# Altium schematic sheet Main.SchDoc: Repeating a sequence
size A3; Author: Idolova Anna; Revision: Version 1.0; SheetNumber: 1; SheetTotal: 2
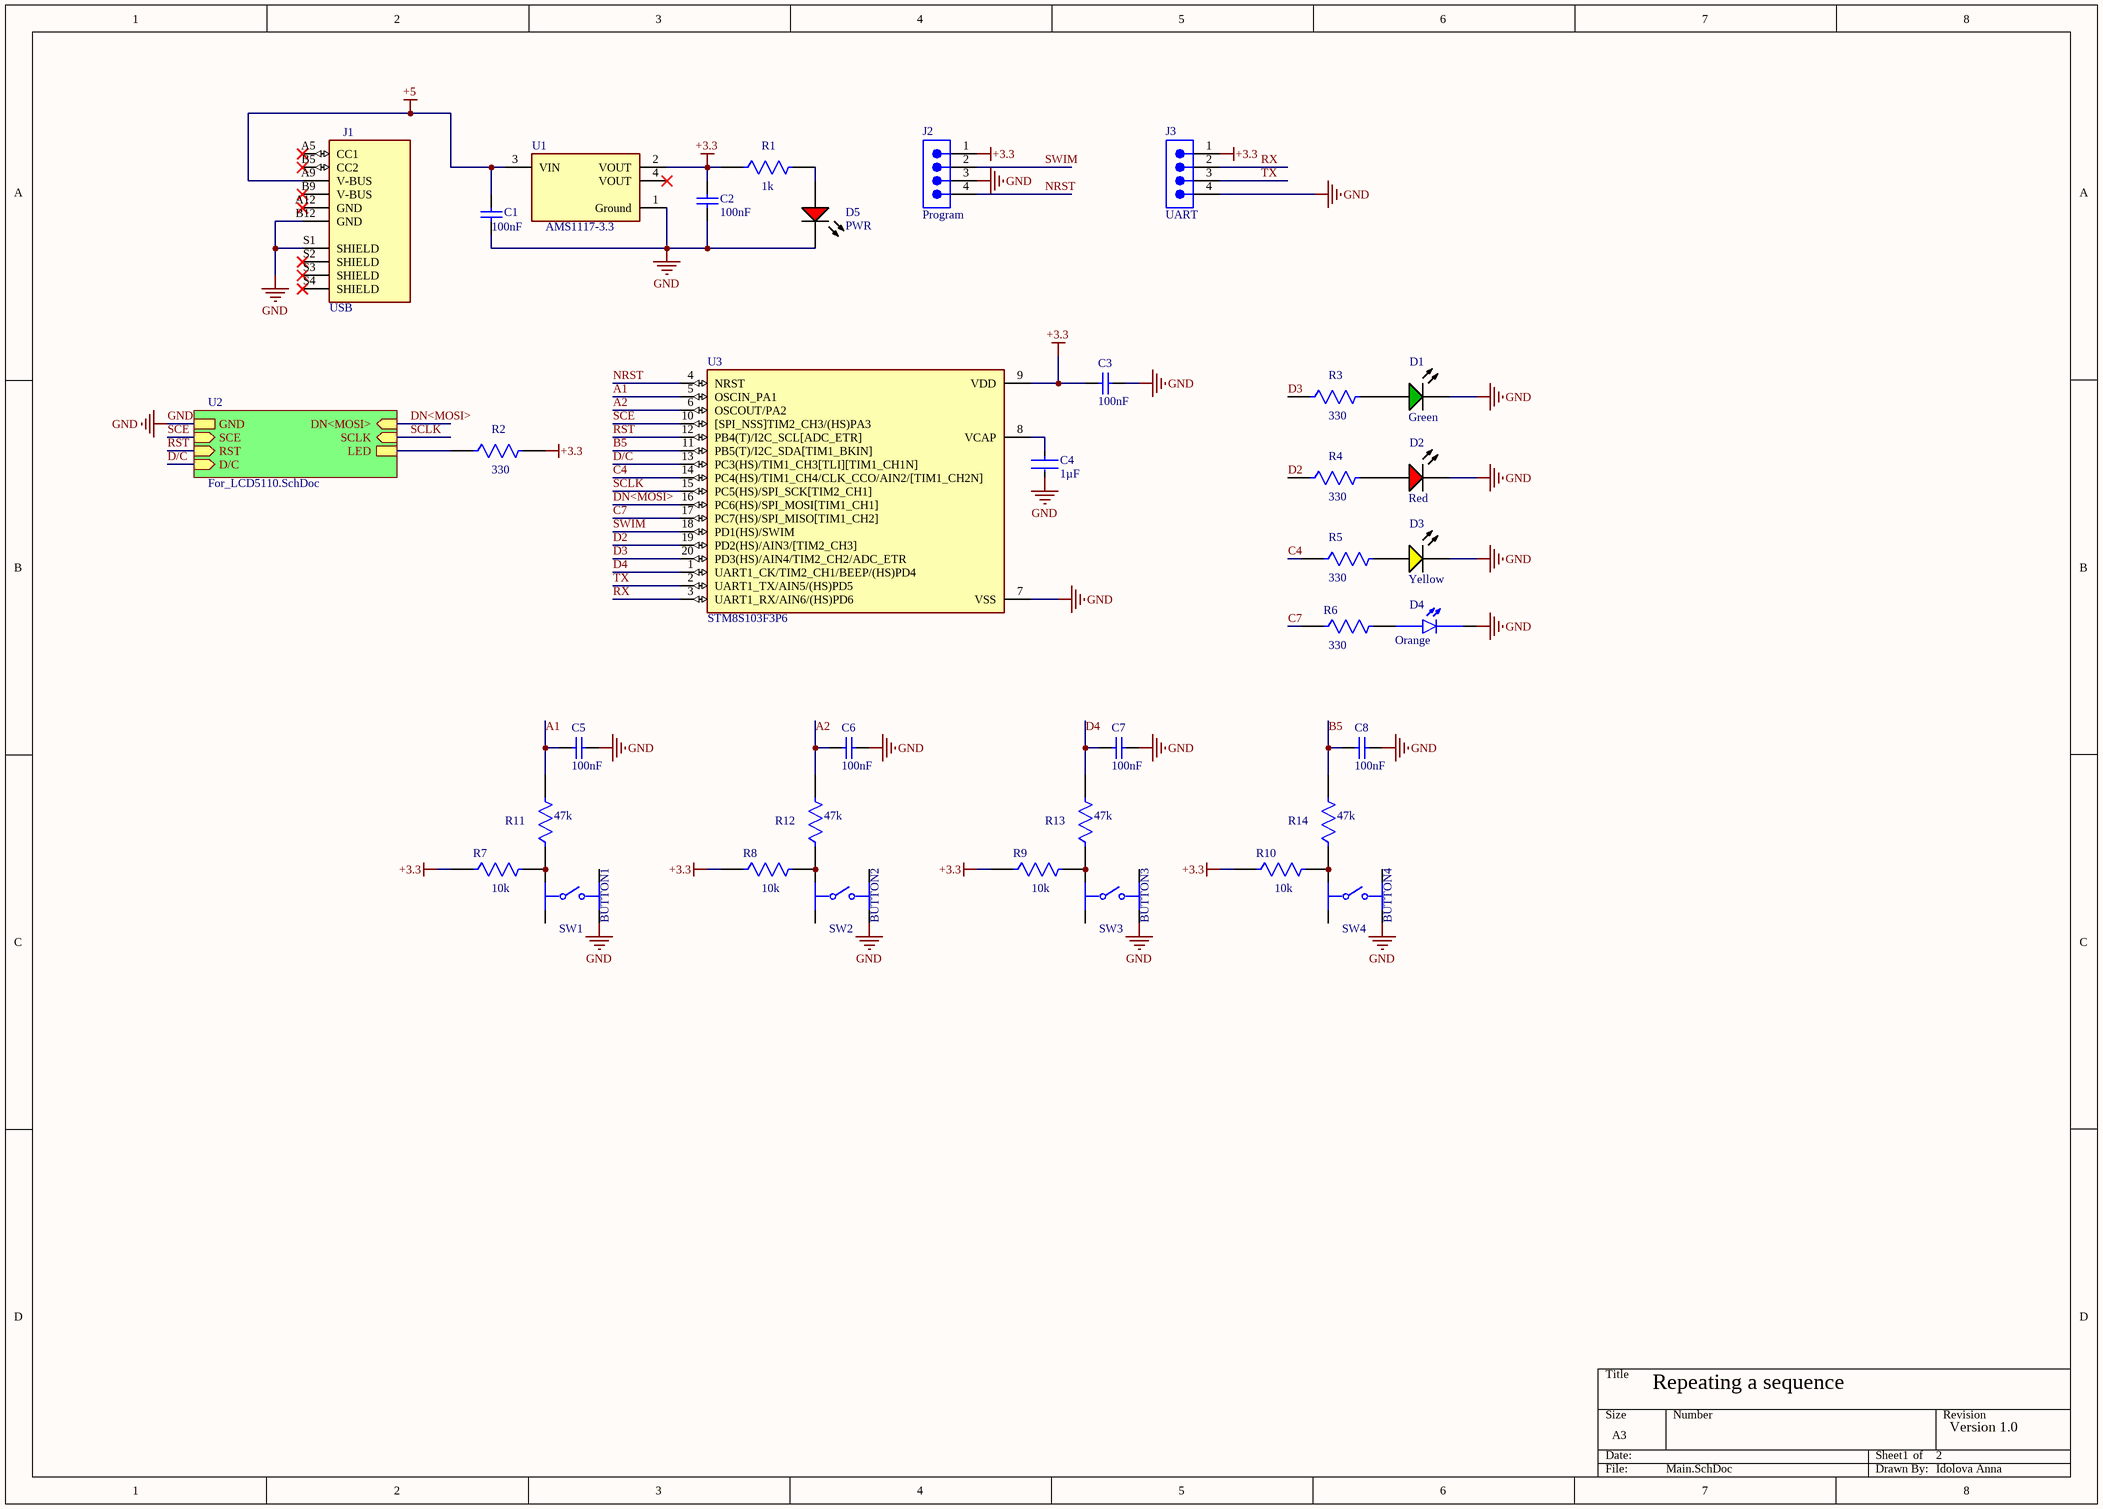
[diagram p0: Main.SchDoc]

## Parts
C1  value 100nF  [CAPC1206(3216)100_N]  (hidden comment: CAPACITOR_1206ZC104JAT2A)
C2  value 100nF  [CAPC1206(3216)100_N]  (hidden comment: CAPACITOR_1206ZC104JAT2A)
C3  value 100nF  [CAPC1206(3216)100_N]  (hidden comment: CAPACITOR_1206ZC104JAT2A)
C4  value 1µF  [FP-CL21-IPC_B]  (hidden comment: CL21F105ZAFNNNF)
C5  value 100nF  [CAPC1206(3216)100_N]  (hidden comment: CAPACITOR_1206ZC104JAT2A)
C6  value 100nF  [CAPC1206(3216)100_N]  (hidden comment: CAPACITOR_1206ZC104JAT2A)
C7  value 100nF  [CAPC1206(3216)100_N]  (hidden comment: CAPACITOR_1206ZC104JAT2A)
C8  value 100nF  [CAPC1206(3216)100_N]  (hidden comment: CAPACITOR_1206ZC104JAT2A)
D1  Green  [KING-WP7113SGD_V]
D2  Red  [KING-WP7113SRDD_V]
D3  Yellow  [KING-WP7113SYD_V]
D4  Orange  [LED_WP7113SEC]
D5  PWR  [KING-WP7113SRDD_V]
J1  USB  [CUI_UJC-HP-3-SMT-TR]
J2  Program  [61300411021]
J3  UART  [61300411021]
R1  value 1k  [FP-RC1005-IPC_C]  (hidden comment: RESISTOR__RC1005F102CS)
R2  value 330  [FP-MCR18-IPC_B]  (hidden comment: MCR18EZPF3300)
R3  value 330  [FP-MCR18-IPC_B]  (hidden comment: MCR18EZPF3300)
R4  value 330  [FP-MCR18-IPC_B]  (hidden comment: MCR18EZPF3300)
R5  value 330  [FP-MCR18-IPC_B]  (hidden comment: MCR18EZPF3300)
R6  value 330  [FP-MCR18-IPC_B]  (hidden comment: MCR18EZPF3300)
R7  value 10k  [FP-TFCR0402-IPC_A]  (hidden comment: TFCR0402-16W-C-1002BT)
R8  value 10k  [FP-TFCR0402-IPC_A]  (hidden comment: TFCR0402-16W-C-1002BT)
R9  value 10k  [FP-TFCR0402-IPC_A]  (hidden comment: TFCR0402-16W-C-1002BT)
R10  value 10k  [FP-TFCR0402-IPC_A]  (hidden comment: TFCR0402-16W-C-1002BT)
R11  value 47k  [FP-RC1005-IPC_C]  (hidden comment: RESISTOR__RC1005F102CS)
R12  value 47k  [FP-RC1005-IPC_C]  (hidden comment: RESISTOR__RC1005F102CS)
R13  value 47k  [FP-RC1005-IPC_C]  (hidden comment: RESISTOR__RC1005F102CS)
R14  value 47k  [FP-RC1005-IPC_C]  (hidden comment: RESISTOR__RC1005F102CS)
SW1  BUTTON1  [FP-PTS645SM43SMTR92LFS-MFG]
SW2  BUTTON2  [FP-PTS645SM43SMTR92LFS-MFG]
SW3  BUTTON3  [FP-PTS645SM43SMTR92LFS-MFG]
SW4  BUTTON4  [FP-PTS645SM43SMTR92LFS-MFG]
U1  AMS1117-3.3  [FP-AMS1117-IPC_B]
U3  STM8S103F3P6  [SOP65P640X120-20N]

## Sub-sheets
U2 = For_LCD5110.SchDoc: GND, SCE (in), RST (in), D/C (in), DN<MOSI> (in), SCLK (in), LED

## Nets
+3.3: C2.2 C3.1 J2.1 J3.1 R1.1 R2.2 R7.1 R8.1 R9.1 R10.1 U1.2(VOUT) U3.9(VDD)
+5: C1.2 J1.A9(V-BUS) U1.3(VIN)
GND: C1.1 C2.1 C3.2 C4.2 C5.2 C6.2 C7.2 C8.2 D1.2(K) D2.2(K) D3.2(K) D4.C D5.2(K) J1.B12(GND) J1.S1(SHIELD) J2.3 J3.4 SW1.2 SW2.2 SW3.2 SW4.2 U1.1(Ground) U3.7(VSS) ; sheet U2/GND
A1: C5.1 R11.1 U3.5(OSCIN_PA1)
A2: C6.1 R12.1 U3.6(OSCOUT/PA2)
B5: C8.1 R14.1 U3.11(PB5(T)/I2C_SDA[TIM1_BKIN])
C4: R5.1 U3.14(PC4(HS)/TIM1_CH4/CLK_CCO/AIN2/[TIM1_CH2N])
C7: R6.1 U3.17(PC7(HS)/SPI_MISO[TIM1_CH2])
D2: R4.1 U3.19(PD2(HS)/AIN3/[TIM2_CH3])
D3: R3.1 U3.20(PD3(HS)/AIN4/TIM2_CH2/ADC_ETR)
D4: C7.1 R13.1 U3.1(UART1_CK/TIM2_CH1/BEEP/(HS)PD4)
D/C: U3.13(PC3(HS)/TIM1_CH3[TLI][TIM1_CH1N]) ; sheet U2/D/C
DN<MOSI>: U3.16(PC6(HS)/SPI_MOSI[TIM1_CH1]) ; sheet U2/DN<MOSI>
NRST: J2.4 U3.4(NRST)
RST: U3.12(PB4(T)/I2C_SCL[ADC_ETR]) ; sheet U2/RST
RX: J3.2 U3.3(UART1_RX/AIN6/(HS)PD6)
SCE: U3.10([SPI_NSS]TIM2_CH3/(HS)PA3) ; sheet U2/SCE
SCLK: U3.15(PC5(HS)/SPI_SCK[TIM2_CH1]) ; sheet U2/SCLK
SWIM: J2.2 U3.18(PD1(HS)/SWIM)
TX: J3.3 U3.2(UART1_TX/AIN5/(HS)PD5)
NetC4_1: C4.1 U3.8(VCAP)
NetD1_1: D1.1(A) R3.2
NetD2_1: D2.1(A) R4.2
NetD5_1: D5.1(A) R1.2
NetR2_1: R2.1 ; sheet U2/LED
NetR7_2: R7.2 R11.2 SW1.3
NetR8_2: R8.2 R12.2 SW2.3
NetR9_2: R9.2 R13.2 SW3.3
NetR10_2: R10.2 R14.2 SW4.3

Not connected (* = marked no-connect by the designer): D3 1(A); D4 A; J1 A5(CC1)* A12(GND)* B5(CC2)* B9(V-BUS)* S2(SHIELD)* S3(SHIELD)* S4(SHIELD)*; R5 2; R6 2; SW1 1 4; SW2 1 4; SW3 1 4; SW4 1 4; U1 4(VOUT)*

## Library data of the parts
C1-C3 C5-C8 = CMP-001-00221-1: Ceramic Capacitor, Multilayer, Ceramic, 10V, 5% +Tol, 5% -Tol, X7R, 15% TC, 0.1uF, Surface Mount, 1206; Multilayer: Yes; JESD-609 Code: e3; Tolerance (fill in as +-): 5%; Case/Package: 1206; Length: 3.2mm; Max Operating Temperature: 125°C; Width: 1.6mm; Rated DC Voltage (URdc): 10V; Temperature Characteristics Code: X7R; Min Operating Temperature: -55°C; Mounting Technology: Surface Mount; Termination: Wraparound; Pins: 2; Dielectric Material: Ceramic; Tolerance  (fill in as +-): 5%; Terminal Finish: Nickel; Package Style: SMTMeter; Package Shape: Rectangular; RoHS Compliant: Yes; Packaging: Tape and Reel; Capacitor Type: Ceramic; Height: 0.94mm; Reach SVHC Compliant: Yes
C4 = CMP-001-00222-1: Ceramic Capacitor, Multilayer, Ceramic, 25V, 80% +Tol, 20% -Tol, Y5V, -82/+22% TC, 1uF, Surface Mount, 0805; Multilayer: Yes; Dielectric Material: Ceramic; Min Operating Temperature: -30°C; Tolerance (fill in as +-): 80%; Termination: Wraparound; Rated DC Voltage (URdc): 25V; Terminal Finish: Nickel; RoHS Compliant: Yes; Temperature Characteristics Code: Y5V; Package Style: SMTMeter; Max Operating Temperature: 85°C; Reach SVHC Compliant: Yes; Width: 1.25mm; Package Shape: Rectangular; Length: 2mm; Tolerance  (fill in as +-): 20%; Case/Package: 0805; Height: 1.35mm; Packaging: Tape and Reel; Capacitor Type: Ceramic; Mounting Technology: Surface Mount; JESD-609 Code: e3; Pins: 2
D1 = CMP-007-00010-2: LED Green, 62.5 mW, 25 mA, -40 to 85 degC, 2-Pin THD, RoHS, Bulk; Manufacturer: Kingbright; Lens Style: Dome; Nominal Vf: 2.2V; Power: 62.5mW; Luminous Intensity: 40mcd; Viewing Angle: 30degrees; Datasheet URL: http://www.kingbrightusa.com/images/catalog/SPEC/WP7113SGD.pdf; Datasheet Version: Rev. 6B, 01/2015; Illumination Colour: Green; Package Quantity: 1000; Package Description: 2-Pin Through Hole Device, Dia 5.9 mm, Body Length 8.6 mm; Colour: Green; Case/Package: Radial; RoHS Compliant: True; Package Reference: WP7113SGD; Mounting Technology: TH; Packaging: Bulk; Forward Voltage: 2.2V
D2 D5 = CMP-007-00033-2: The Super Bright Red Source Color Device, 1.85 V, -40 to 85 degC, 2-Pin THD, RoHS, Tape and Reel; Manufacturer: Kingbright; Nominal Vf: 1.85V; Luminous Intensity: 300mcd; Viewing Angle: 30degrees; Lens Style: Diffused; RoHS Compliant: True; Datasheet Version: Rev. 6A, 07/2016; Illumination Colour: Red; Case/Package: Radial; Package Reference: WP7113SRDD; Package Quantity: 500; Datasheet URL: http://www.kingbrightusa.com/images/catalog/SPEC/WP7113SRD-D.pdf; Colour: Red; Packaging: Bulk; Forward Voltage: 1.85V; Mounting Technology: TH; Package Description: 2-Pin Through Hole Device, Dia 5.9 mm, Body Length 8.6 mm
D3 = CMP-007-00034-2: The Super Bright Yellow Source Color Device, 2 V, -40 to 85 degC, 2-Pin THD, RoHS, Tape and Reel; Manufacturer: Kingbright; Nominal Vf: 2V; Viewing Angle: 30degrees; Luminous Intensity: 600mcd; Forward Current: 20mA; Lens Style: Diffused; Datasheet Version: Rev. 7B, 01/2015; RoHS Compliant: True; Datasheet URL: http://www.kingbrightusa.com/images/catalog/SPEC/WP7113SYD.pdf; Illumination Colour: Yellow; Package Reference: WP7113SYD; Mounting Technology: TH; Package Quantity: 500; Packaging: Bulk; Package Description: 2-Pin Through Hole Device, Dia 5.9 mm, Body Length 8.6 mm; Case/Package: Radial; Colour: Yellow; Forward Voltage: 2V
D4 = CMP-004-00038-1: LED Thru-Hole Orange T1-3/4 5mm Clear Lens 30mA 610nm 2500mcd Round; MF: Kingbright; Source: WP7113SEC.SchLib; Check_prices: https://www.snapeda.com/parts/WP7113SEC/Kingbright/view-part/?ref=eda; Value: *; Case/Package: Radial Kingbright; MP: WP7113SEC; Component Type: Standard; Pins: 2; SnapEDA_Link: https://www.snapeda.com/parts/WP7113SEC/Kingbright/view-part/?ref=snap; Design Item ID: WP7113SEC
J1 = CMP-074-000000-1: Pin Count: 10; Design Item ID: UJC-HP-3-SMT-TR; Price: None; Availability: Unavailable; Component Type: Standard; Source: UJC-HP-3-SMT-TR.SchLib; Value: *; MP: UJC-HP-3-SMT-TR; Package: None
J2 J3 = CMP-043-000000-1: NexarPartId: 31153320; Gender: Male; Number of Positions: 4; Current Rating: 3A; Pitch: 2.54mm; Contact Resistance: 20m?; Connector Type: Male Pin; Operating Supply Voltage: 250V; Contact Mating Length: 5.9944mm; Number of Rows: 1; Contact Plating: Gold; Design Item ID: CMP-1502-01063-3; Lead Pitch: 2.54mm; Component Type: Standard; Number of Pins: 4; Number of Contacts: 4; Mount: Through Hole; REACH SVHC: Unknown; Source: Components - 25.08.25 - 11.48.SchLib; Contact Material: Copper; Pin Count: 4; Termination: Solder; RoHS: Compliant; Color: Black
R1 = CMP-009-00419-1: Fixed Resistor, Metal Glaze/thick Film, 0.06W, 1000ohm, 50V, 1% +/-Tol, 100ppm/Cel, Surface Mount, 0402; Package Height: 0.35mm; Power: 60mW; Package Length: 1mm; Package Width: 0.5mm; Temperature Coefficient (ppm/Cel): 100; JESD-609 Code: e3; Max Operating Temperature: 125°C; Resistor Type: FIXED RESISTOR; Pins: 2; Package Shape: Rectangular; Tolerance: 1%; Case/Package: 0402; Mounting Technology: Surface Mount; Reach SVHC Compliant: Yes; Packaging: Tape and Reel; RoHS Compliant: Yes; Technology: METAL GLAZE/THICK FILM; Min Operating Temperature: -55°C; Working Voltage: 50V; Construction: Chip; Terminal Finish: Nickel
R2-R6 = CMP-009-00420-1: Fixed Resistor, Metal Glaze/thick Film, 0.25W, 330ohm, 200V, 1% +/-Tol, 100ppm/Cel, Surface Mount, 1206; Temperature Coefficient (ppm/Cel): 100; Package Length: 3.2mm; Package Width: 1.6mm; Package Height: 0.55mm; Power: 250mW; Reference Standard: TS 16949; Rated Temperature: 70°C; JESD-609 Code: e3; Max Operating Temperature: 155°C; Tolerance: 1%; Mounting Technology: Surface Mount; Case/Package: 1206; Resistor Type: FIXED RESISTOR; Working Voltage: 200V; Technology: METAL GLAZE/THICK FILM; RoHS Compliant: Yes; Terminal Finish: Nickel; Package Shape: Rectangular; Min Operating Temperature: -55°C; Termination: Wraparound; Packaging: Tape and Reel; Reach SVHC Compliant: Yes; Pins: 2; Construction: Rectangular
R7-R10 = CMP-009-00435-1: Fixed Resistor, Thin Film, 0.063W, 10000ohm, 25V, 0.1% +/-Tol, 50ppm/Cel, Surface Mount, 0402; Temperature Coefficient: 50ppm/°C; Power Dissipation: 63mW; Composition: Thin Film; Lifecycle Status: Production; Max Operating Temperature: 155°C; Mounting Technology: Surface Mount; Working Voltage: 25V; RoHS: Compliant; Voltage Rating: 25V; Width: 500µm; Power Rating: 63mW; REACH SVHC: Yes; Height: 300µm; Case/Package: 0402; China RoHS: Compliant; Tolerance: 0.1%; Min Operating Temperature: -55°C; Number of Terminals: 2
R11-R14 = CMP-009-00449-1: Res Thin Film 0603 47K Ohm 0.1% 0.063W(1/16W) ±25ppm/C Pad SMD T/R Medical; Manufacturer Lifecycle Status: ACTIVE; Temperature Coefficient: 25ppm/°C; Number of Resistors: 1; Operating Supply Voltage: 50V; Power Dissipation: 63mW; Termination: Solder; RoHS: Compliant; Lifecycle Status: Production; Width: 800µm; Height: 450µm; Min Operating Temperature: -55°C; Mounting Technology: Surface Mount; REACH SVHC: Yes; Case Code (Imperial): 0603; Voltage Rating: 50V; Number of Terminations: 2; Case/Package: 0603; Voltage Rating (DC): 50V; ELV: Compliant; Weight: 2.012816mg; Tolerance: 0.1%; Working Voltage: 50V; Packaging: Tape & Reel; Max Power Dissipation: 63mW; Number of Terminals: 2; Depth: 800µm; China RoHS: Compliant; Case Code (Metric): 1608; Composition: Thin Film; Max Operating Temperature: 155°C; Power Rating: 63mW; Length: 1.5494mm
SW1-SW4 = CMP-00012-1: Keypad Switch, 1 Switches, SPST, Momentary-tactile, 0.05A, 12VDC, 1.57N, 4 PCB Hole Cnt, Solder Terminal, Surface Mount-straight; Body Breadth: 5.9944mm; Dielectric Withstand Volts: 250VACV; Contact Resistance: 0.1mR; Contact Voltage(DC)-Max: 12V; Insulation Resistance: 100GR; Contact Current(DC)-Max: 50mA; Actuator Type: Pushbutton; Contact DC Max Rating R Load: 0.05A@12VDC; Body Height: 3.4544mm; PCB Hole Count: 4; Switch Type: Keypad; Termination: Solder; Switch Action: MOMENTARY; Min Operating Temperature: -20°C; Mounting Technology: Surface Mount; Max Operating Temperature: 60°C; Terminal Finish: Silver; Terminal Length: 0.138inch; Reach SVHC Compliant: Yes; Switch Function: SPST; RoHS Compliant: Yes; Body Length or Diameter: 5.9944mm; JESD-609 Code: e4
U1 = CMP-012-00000-1: Fixed Positive LDO Regulator, 3.3V, 1.3V Dropout, PDSO3; Package Body Material: Plastic; Channels: 1; Regulator Type: FIXED POSITIVE SINGLE OUTPUT LDO REGULATOR; Output Voltage1-Max: 3.399V; Output Current1-Max: 1A; Output Voltage1-Min: 3.201V; Height - Seated (Max): 1.8mm; Reach SVHC Compliant: Yes; Terminal Pitch: 2.29mm; Operating Temperature, TJ-Min: -40°C; Package Shape: Rectangular; RoHS Compliant: Yes; Case/Package: SOP; JESD-30 Code: R-PDSO-G3; Pins: 3; Dropout Voltage1-Max: 1.3V; Terminal Position: DUAL; Surface Mount: Yes; Package Style: SMALL OUTLINEMeter; Operating Temperature, TJ-Max: 125°C; Width: 3.505mm; Output Voltage1-Nom: 3.3V; Terminal Form: Gull Wing; Length: 6.505mm
U3 = CMP-031-00014-1: STM8 series Microcontroller IC 8-Bit 16MHz 8KB (8K x 8) FLASH 20-TSSOP; MF: STMicroelectronics; Value: *; MP: STM8S103F3P6; Component Type: Standard; Case/Package: TSSOP-20 STMicroelectronics; Pins: 20; Check_prices: https://www.snapeda.com/parts/STM8S103F3P6/STMicroelectronics/view-part/?ref=eda; SnapEDA_Link: https://www.snapeda.com/parts/STM8S103F3P6/STMicroelectronics/view-part/?ref=snap; Design Item ID: STM8S103F3P6; Source: STM8S103F3P6.SchLib